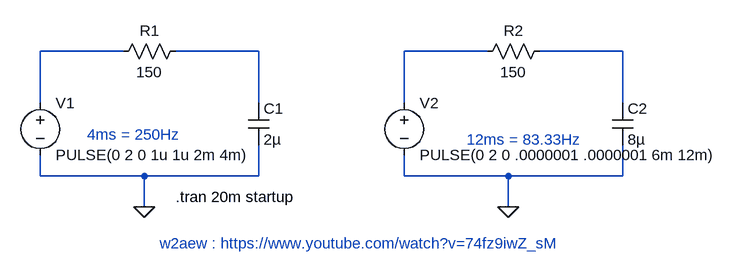
[diagram p0: schematic Mesure1.asc]
Mesure1.asc, the LTspice schematic file:
Version 4
SHEET 1 1108 680
WIRE 160 64 32 64
WIRE 368 64 240 64
WIRE 720 64 592 64
WIRE 928 64 800 64
WIRE 32 144 32 64
WIRE 368 144 368 64
WIRE 592 144 592 64
WIRE 928 144 928 64
WIRE 32 256 32 224
WIRE 192 256 32 256
WIRE 368 256 368 208
WIRE 368 256 192 256
WIRE 592 256 592 224
WIRE 752 256 592 256
WIRE 928 256 928 208
WIRE 928 256 752 256
WIRE 192 304 192 256
WIRE 752 304 752 256
FLAG 192 304 0
FLAG 752 304 0
SYMBOL voltage 32 128 R0
WINDOW 123 0 0 Left 0
WINDOW 39 0 0 Left 0
SYMATTR InstName V1
SYMATTR Value PULSE(0 2 0 1u 1u 2m 4m)
SYMBOL res 256 48 R90
WINDOW 0 0 56 VBottom 2
WINDOW 3 32 56 VTop 2
SYMATTR InstName R1
SYMATTR Value 150
SYMBOL cap 352 144 R0
SYMATTR InstName C1
SYMATTR Value 2µ
SYMBOL voltage 592 128 R0
WINDOW 123 0 0 Left 0
WINDOW 39 0 0 Left 0
SYMATTR InstName V2
SYMATTR Value PULSE(0 2 0 .0000001 .0000001 6m 12m)
SYMBOL res 816 48 R90
WINDOW 0 0 56 VBottom 2
WINDOW 3 32 56 VTop 2
SYMATTR InstName R2
SYMATTR Value 150
SYMBOL cap 912 144 R0
SYMATTR InstName C2
SYMATTR Value 8µ
TEXT 240 288 Left 2 !.tran 20m startup
TEXT 104 192 Left 2 ;4ms = 250Hz
TEXT 688 200 Left 2 ;12ms = 83.33Hz
TEXT 216 360 Left 2 ;w2aew : https://www.youtube.com/watch?v=74fz9iwZ_sM

The netlist it stands for:
* Mesure1.asc
V1 N001 0 PULSE(0 2 0 1u 1u 2m 4m)
R1 N002 N001 150
C1 N002 0 2µ
V2 N003 0 PULSE(0 2 0 .0000001 .0000001 6m 12m)
R2 N004 N003 150
C2 N004 0 8µ
.tran 20m startup
* 4ms = 250Hz
* 12ms = 83.33Hz
* w2aew : https://www.youtube.com/watch?v=74fz9iwZ_sM
.backanno
.end